# EAGLE schematic Exp_Board_Slolu (EAGLE 6.4)
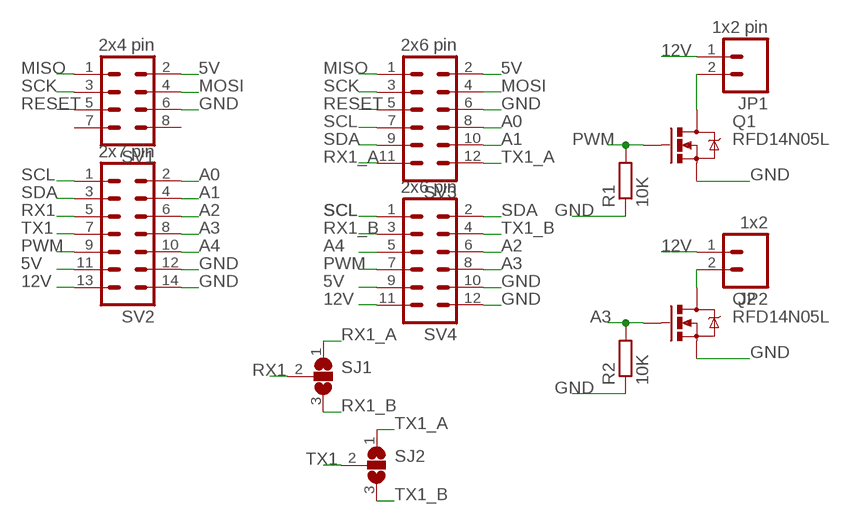
[diagram p0: schematic, sheet 1]

## Parts
JP1  1x2 pin  M02PTH  [1X02]
JP2  1x2  M02PTH  [1X02]
Q1  RFD14N05L  MOSFET-NCHANNELPTH2  [TO220V]
Q2  RFD14N05L  MOSFET-NCHANNELPTH2  [TO220V]
R1  10K  R-EU_0204/7  [0204/7]
R2  10K  R-EU_0204/7  [0204/7]
SJ1  SJ2W  [SJ_2]
SJ2  SJ2W  [SJ_2]
SV1  2x4 pin  MA04-2  [MA04-2]
SV2  2x7 pin  MA07-2  [MA07-2]
SV3  2x6 pin  MA06-2  [MA06-2]
SV4  2x6 pin  MA06-2  [MA06-2]

## Nets
5V: SV1.2 SV2.11 SV3.2 SV4.9
12V: JP1.1 JP2.1 SV2.13 SV4.11
A0: SV2.2 SV3.8
A1: SV2.4 SV3.10
A2: SV2.6 SV4.6
A3: Q2.1(G) R2.2 SV2.8 SV4.8
A4: SV2.10 SV4.5
GND: Q1.3(S) Q2.3(S) R1.1 R2.1 SV1.6 SV2.12 SV2.14 SV3.6 SV4.10 SV4.12
MISO: SV1.1 SV3.1
MOSI: SV1.4 SV3.4
N$1: JP1.2 Q1.2(D)
N$2: JP2.2 Q2.2(D)
PWM: Q1.1(G) R1.2 SV2.9 SV4.7
RESET: SV1.5 SV3.5
RX1: SJ1.2 SV2.5
RX1_A: SJ1.1 SV3.11
RX1_B: SJ1.3 SV4.3
SCK: SV1.3 SV3.3
SCL: SV2.1 SV3.7 SV4.1
SDA: SV2.3 SV3.9 SV4.2
TX1: SJ2.2 SV2.7
TX1_A: SJ2.1 SV3.12
TX1_B: SJ2.3 SV4.4
Unconnected: SV1.7 SV1.8

## Library data of the parts
JP1 JP2 = SparkFun-Connectors:M02: Header 2 Standard 2-pin 0.1" header. Use with straight break away headers (SKU : PRT-00116), right angle break away headers (PRT-00553), swiss pins (PRT-00743), machine pins (PRT-00117), and female headers (PRT-00115). Molex polarized connector foot print use with SKU : PRT-08233 with associated crimp pins and housings.
Q1 Q2 = SparkFun-DiscreteSemi:MOSFET-NCHANNEL: Generic NMOS footprint
R1 R2 = resistor:R-EU_: RESISTOR, European symbol
SJ1 SJ2 = jumper:SJ2W: SMD solder JUMPER
SV1 = con-lstb:MA04-2: PIN HEADER; OC_FARNELL: unknown; OC_NEWARK: unknown
SV2 = con-lstb:MA07-2: PIN HEADER; OC_FARNELL: unknown; OC_NEWARK: unknown
SV3 SV4 = con-lstb:MA06-2: PIN HEADER; OC_FARNELL: unknown; OC_NEWARK: unknown